# Altium project M-heat.PrjPcb
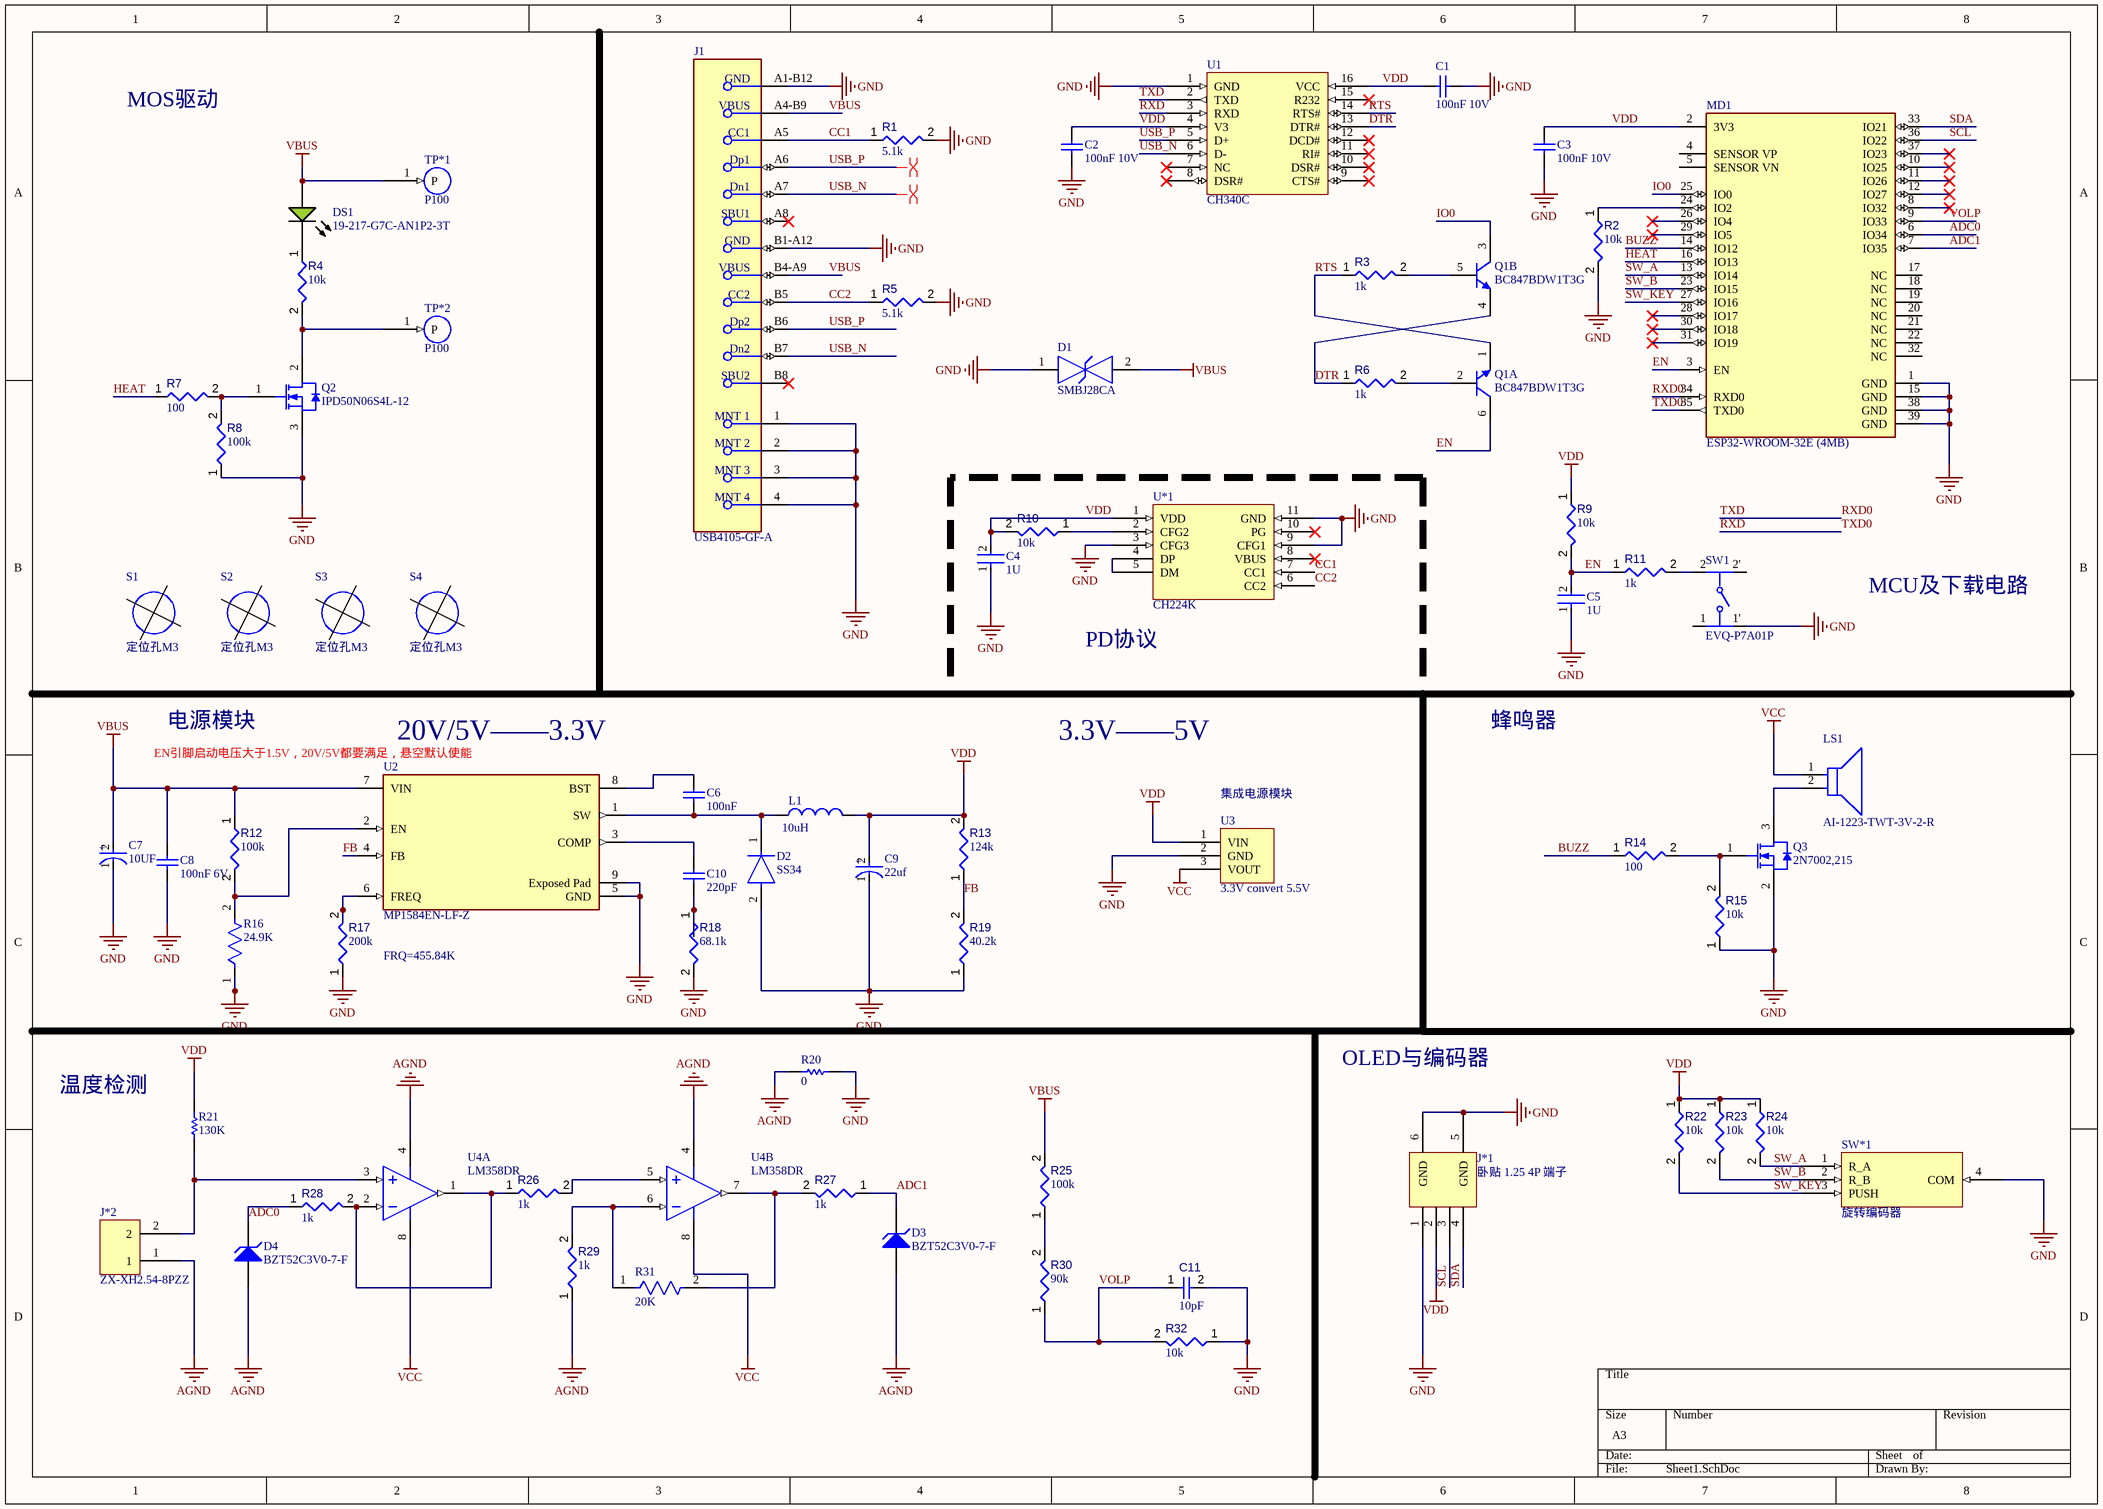
[diagram p0: Sheet1.SchDoc]
1 sheet, 70 parts. Net scope: global (net labels, ports and power ports of the same name join across sheets).
Board files: control_board.PcbDoc, Bed.pcbdoc, struct_board.PcbDoc

## Sheet Sheet1.SchDoc
size A3; SheetNumber: 1; SheetTotal: 1

### Parts
C1  100nF 10V  [CAPC0603(1608)100_M]
C2  100nF 10V  [CAPC0603(1608)100_M]
C3  100nF 10V  [CAPC0603(1608)100_M]
C4  1U  [FP-0603-L_1_6_0_15-W_0_81-IPC_A]
C5  1U  [FP-0603-L_1_6_0_15-W_0_81-IPC_A]
C6  100nF  [CAPC0603(1608)100_M]
C7  10UF  [FP-SC-MFG]
C8  100nF 6V  [CAPC0603(1608)100_M]
C9  22uf  [FP-TAJC-MFG]
C10  220pF  [CAPC1608X90X35LL10T15]
C11  value 10pF  [CAPC1608X90X40ML10T20]  (hidden comment: Capacitor 10 pF +/- 5% 50 V 0603)
D1  SMBJ28CA  [FP-SMBJ-CA-MFG]
D2  SS34  [FP-95401-MFG]
D3  BZT52C3V0-7-F  [DIOD-SOD123_V]
D4  BZT52C3V0-7-F  [DIOD-SOD123_V]
DS1  19-217-G7C-AN1P2-3T  [EVRL-0603-2_V]
J1  USB4105-GF-A  [FP-USB4105-GF-A-MFG]
J*1  卧贴 1.25 4P 端子  [卧贴 1.25 4P 端子-Footprint-1]
J*2  ZX-XH2.54-8PZZ  [ZX-XH2.54-8PZZ-Footprint-1]
L1  10uH  [INDM7266X28N]
LS1  AI-1223-TWT-3V-2-R  [FP-AI-1223-TWT-3V-2-R-MFG]
MD1  ESP32-WROOM-32E (4MB)  [FP-ESP32-WROOM-32E_4MB-MFG]
Q1  BC847BDW1T3G  [ONSC-SOT-363-6-419B-02_W_V]  (parts A,B of 2)
Q2  IPD50N06S4L-12  [INF-PG-TO252-3-11_M]
Q3  2N7002,215  [NXP-SOT23-3_V]
R1  value 5.1k  [RESC1608X55X25ML10T15]  (hidden comment: Resistor 5.1K +/-1% 0603 100 mW)
R2  value 10k  [RESC1608X55X25ML10T15]  (hidden comment: Resistor 1k +/-1% 0603 100 mW)
R3  value 1k  [RESC1608X55X25ML10T15]  (hidden comment: Resistor 1k +/-1% 0603 100 mW)
R4  value 10k  [RESC1608X55X25ML10T15]  (hidden comment: Resistor 10k +/-1% 0603 100 mW)
R5  value 5.1k  [RESC1608X55X25ML10T15]  (hidden comment: Resistor 1k +/-1% 0603 100 mW)
R6  value 1k  [RESC1608X55X25ML10T15]  (hidden comment: Resistor 1k +/-1% 0603 100 mW)
R7  value 100  [RESC0603(1608)_L]  (hidden comment: 100R3J)
R8  value 100k  [RESC1608X55X25ML10T15]  (hidden comment: Resistor 100k +/-1% 0603 100 mW)
R9  value 10k  [RESC1608X55X25ML10T15]  (hidden comment: Resistor 1k +/-1% 0603 100 mW)
R10  value 10k  [RESC1608X55X25ML10T15]  (hidden comment: Resistor 1k +/-1% 0603 100 mW)
R11  value 1k  [RESC1608X55X25ML10T15]  (hidden comment: Resistor 1k +/-1% 0603 100 mW)
R12  value 100k  [RESC1608X55X25ML10T15]  (hidden comment: Resistor 100k +/-1% 0603 100 mW)
R13  value 124k  [RESC1608X55X25ML10T15]  (hidden comment: Resistor 100k +/-1% 0603 100 mW)
R14  value 100  [RESC0603(1608)_L]  (hidden comment: 100R3J)
R15  value 10k  [RESC1608X55X25ML10T15]  (hidden comment: Resistor 10k +/-1% 0603 100 mW)
R16  24.9K  [FP-RC_L0603-MFG]
R17  value 200k  [RESC1608X55X25ML10T15]  (hidden comment: Resistor 100k +/-1% 0603 100 mW)
R18  value 68.1k  [RESC1608X55X25ML10T15]  (hidden comment: Resistor 100k +/-1% 0603 100 mW)
R19  value 40.2k  [RESC1608X55X25ML10T15]  (hidden comment: Resistor 100k +/-1% 0603 100 mW)
R20  value 0  [RESC1608X55X25ML10T15]  (hidden comment: Resistor 0R +/- 5% 0603 100 mW)
R21  130K  [RESC1609X50X30NL10T20]
R22  value 10k  [RESC1608X55X25ML10T15]  (hidden comment: Resistor 10k +/-1% 0603 100 mW)
R23  value 10k  [RESC1608X55X25ML10T15]  (hidden comment: Resistor 10k +/-1% 0603 100 mW)
R24  value 10k  [RESC1608X55X25ML10T15]  (hidden comment: Resistor 10k +/-1% 0603 100 mW)
R25  value 100k  [RESC1608X55X25ML10T15]  (hidden comment: Resistor 100k +/-1% 0603 100 mW)
R26  value 1k  [RESC1608X55X25ML10T15]  (hidden comment: Resistor 1k +/-1% 0603 100 mW)
R27  value 1k  [RESC1608X55X25ML10T15]  (hidden comment: Resistor 1k +/-1% 0603 100 mW)
R28  value 1k  [RESC1608X55X25ML10T15]  (hidden comment: Resistor 1k +/-1% 0603 100 mW)
R29  value 1k  [RESC1608X55X25ML10T15]  (hidden comment: Resistor 1k +/-1% 0603 100 mW)
R30  value 90k  [RESC1608X55X25ML10T15]  (hidden comment: Resistor 90k +/-1% 0603 100 mW)
R31  20K  [FP-RC0603-0_55-IPC_C]
R32  value 10k  [RESC1608X55X25ML10T15]  (hidden comment: Resistor 10k +/-1% 0603 100 mW)
S1  定位孔M3  [定位孔M3-Footprint-1]
S2  定位孔M3  [定位孔M3-Footprint-1]
S3  定位孔M3  [定位孔M3-Footprint-1]
S4  定位孔M3  [定位孔M3-Footprint-1]
SW1  EVQ-P7A01P  [FP-EVQ-P7A01P-MFG]
SW*1  旋转编码器  [旋转编码器-Footprint-1]
TP*1  P100  [P100-Footprint-1]
TP*2  P100  [P100-Footprint-1]
U1  CH340C  [SOP127P610X180-16N]
U2  MP1584EN-LF-Z  [FP-MP1584EN-LF-Z-MFG]
U3  3.3V convert 5.5V  [3.3V convert 5.5V-Footprint-1]
U4  LM358DR  [D0008A_L]  (parts A,B of 2)
U*1  CH224K  [SOP100P610X180_HS-12N]

### Nets
AGND: D3.1(A) D4.1(A) J*2.1 R20.1 R29.1 U4.4(GND)
GND: C1.2 C2.1 C3.2 C4.1 C5.1 C7.1(C) C8.1 C9.1(C) C11.2 D1.1 D2.2(A) J1.1(MNT_1) J1.2(MNT_2) J1.3(MNT_3) J1.4(MNT_4) J1.A1-B12(GND) J1.B1-A12(GND) J*1.1 J*1.5(GND) J*1.6(GND) MD1.1(GND) MD1.15(GND) MD1.38(GND) MD1.39(GND) Q2.3(SOURCE) Q3.2(S) R1.2 R2.2 R5.2 R8.1 R15.1 R16.1 R17.1 R18.2 R19.1 R20.2 R32.1 SW1.1' SW*1.4(COM) U1.1(GND) U2.5(GND) U2.9(Exposed_Pad) U3.2(GND) U*1.3(CFG3) U*1.9(CFG1) U*1.11(GND)
VBUS: C7.2(A) C8.2 D1.2 DS1.1(A) J1.A4-B9(VBUS) J1.B4-A9(VBUS) R12.1 R25.2 TP*1.1(P) U2.7(VIN)
VCC: LS1.1(C) U3.3(VOUT) U4.8(VCC)
VDD: C1.1 C2.2 C3.1 C4.2 C9.2(A) J*1.2 L1.2 MD1.2(3V3) R9.1 R10.2 R13.2 R21.2 R22.1 R23.1 R24.1 U1.4(V3) U1.16(VCC) U3.1(VIN) U*1.1(VDD)
ADC0: D4.2(K) MD1.6(IO34) R28.1
ADC1: D3.2(K) MD1.7(IO35) R27.1
BUZZ: MD1.14(IO12) R14.1
CC1: J1.A5(CC1) R1.1 U*1.7(CC1)
CC2: J1.B5(CC2) R5.1 U*1.6(CC2)
DTR: Q1.4(E) R6.1 U1.13(DTR#)
EN: C5.2 MD1.3(EN) Q1.6(C) R9.2 R11.1
FB: R13.1 R19.2 U2.4(FB)
HEAT: MD1.16(IO13) R7.1
IO0: MD1.25(IO0) Q1.3(C)
RTS: Q1.1(E) R3.1 U1.14(RTS#)
RXD: MD1.35(TXD0) U1.3(RXD)  [also labelled TXD0]
RXD0: MD1.34(RXD0) U1.2(TXD)  [also labelled TXD]
SCL: J*1.3 MD1.36(IO22)
SDA: J*1.4 MD1.33(IO21)
SW_A: MD1.13(IO14) R24.2 SW*1.1(R_A)
SW_B: MD1.23(IO15) R23.2 SW*1.2(R_B)
SW_KEY: MD1.27(IO16) R22.2 SW*1.3(PUSH)
USB_N: J1.A7(Dn1) J1.B7(Dn2) U1.6(D-)
USB_P: J1.A6(Dp1) J1.B6(Dp2) U1.5(D+)
VOLP: C11.1 MD1.9(IO33) R30.1 R32.2
NetC6_1: C6.1 D2.1(C) L1.1 U2.1(SW)
NetC6_2: C6.2 U2.8(BST)
NetC10_1: C10.1 U2.3(COMP)
NetC10_2: C10.2 R18.1
NetDS1_2: DS1.2(K) R4.1
NetJ*2_2: J*2.2 R21.1 U4.3(1IN+)
NetLS1_2: LS1.2(A) Q3.3(D)
NetMD1_24: MD1.24(IO2) R2.1
NetQ1_2: Q1.2(B) R6.2
NetQ1_5: Q1.5(B) R3.2
NetQ2_1: Q2.1(GATE) R7.2 R8.2
NetQ2_2: Q2.2(DRAIN) R4.2 TP*2.1(P)
NetQ3_1: Q3.1(G) R14.2 R15.2
NetR10_1: R10.1 U*1.2(CFG2)
NetR11_2: R11.2 SW1.2
NetR12_2: R12.2 R16.2 U2.2(EN)
NetR17_2: R17.2 U2.6(FREQ)
NetR25_1: R25.1 R30.2
NetR26_1: R26.1 R28.2 U4.1(1OUT) U4.2(1IN-)
NetR26_2: R26.2 U4.5(2IN+)
NetR27_2: R27.2 R31.2 U4.7(2OUT)
NetR29_2: R29.2 R31.1 U4.6(2IN-)
NetU*1_4: U*1.4(DP) U*1.5(DM)

Not connected (* = marked no-connect by the designer): J1 A8(SBU1)* B8(SBU2)*; MD1 4(SENSOR_VP) 5(SENSOR_VN) 8(IO32)* 10(IO25)* 11(IO26)* 12(IO27)* 17(NC) 18(NC) 19(NC) 20(NC) 21(NC) 22(NC) 26(IO4)* 28(IO17)* 29(IO5)* 30(IO18)* 31(IO19)* 32(NC) 37(IO23)*; SW1 1 2'; U1 7(NC)* 8(DSR#)* 9(CTS#)* 10(DSR#)* 11(RI#)* 12(DCD#)* 15(R232)*; U*1 8(VBUS)* 10(PG)*

### Layout directives
differential pair: USB_N, USB_P

### Notes on the sheet
- MOS驱动
- (near U*1) PD协议
- MCU及下载电路
- EN引脚启动电压大于1.5V，20V/5V都要满足，悬空默认使能
- 电源模块
- (near U2) 20V/5V——3.3V
- 3.3V——5V
- 蜂鸣器
- (near U3) 集成电源模块
- FRQ=455.84K
- 温度检测
- OLED与编码器
- (in symbol CMP-04424-000472-1) +
- (in symbol CMP-05427-000087-1) +

### Library data of the parts
C1-C3 C6 C8 = CMP-1035-02580-1: CAP 100nF 10V ±10% 0603 (1608 Metric) Thickness 1mm SMD; Tolerance: Â±10%; Case-EIA: 0603; Case-Metric: 1608; Max Thickness: 1 mm; Value: 100nF; Rated Voltage: 10 V; Technology: SMT
C4 C5 = CMP-2006-04474-2: General Purpose Ceramic Capacitor, 0603, 1uF, 10%, X5R, 15%, 6.3V
C7 = CMP-05427-000087-1: CAP ALUM 10UF 20% 35V SMD; Lead Length: 2.2mm; Leakage Current: 3uA; Ripple Current (AC): 30mA; Life (Hours): 2000Hour; RoHS Compliant: Yes; Case/Package: Radial; REACH SVHC: No SVHC; Max Operating Temperature: 85°C; Series: S; Number of Pins: 2; Min Operating Temperature: -40°C; Packaging: Tape and Reel; Termination: SMD/SMT; Voltage Rating: 35V; Tolerance: 20%; Length: 5.5mm; Height - Seated (Max): 0.213inch; Voltage Rating (DC): 35V; Height: 5.4mm; Radiation Hardening: No; Width: 5.3mm; Diameter: 5mm; Ripple Current: 30mA; Voltage: 35V; Package Quantity: 1; Capacitance: 10uF; Mount: Surface Mount; Contact Plating: Tin; Construction: Cylindrical; Lead Pitch: 1.5mm
C9 = CMP-04424-000472-1: 220uF 6.3V  ±10% 1.2Ω 2312  SMD Tantalum Capacitor; Polarity: Polar; Dissipation Factor: 8%; Leakage Current: 13.9uA; ESR (Equivalent Series Resistance): 1.2R; Capacitance: 220uF; Voltage Rating (DC): 6.3V; REACH SVHC: No SVHC; Construction: Flat; Dielectric Material: Tantalum; Depth: 3.2mm; Width: 3.2mm; RoHS Compliant: Yes; Case Code (Imperial): 2312; Max Operating Temperature: 125°C; Tolerance: 10%; Case/Package: 2412; Mount: Surface Mount; Voltage: 6.3V; Series: TAJ; Voltage Rating: 6.3V; Height - Seated (Max): 0.11inch; Package Quantity: 500; Height: 2.6mm; Number of Pins: 2; Case Code (Metric): 6032; Termination: SMD/SMT; Lead Free: Lead Free; Length: 6mm; Min Operating Temperature: -55°C; Radiation Hardening: No; Packaging: Tape and Reel; Features: General Purpose
C10 = CMP-2006-02613-1: Manufacturer: Murata; Part Number: GRM1885C1H151JA01D
C11 = CMP-001-00014-6: Chip Capacitor, 10 pF, +/- 5%, 50 V, 0603 (1608 Metric); Capacitor Type: Ceramic; Voltage Rating: 50V; RoHS Compliant: True; Case/Package: 0603; Max Operating Temperature: 125°C; Pins: 2; Tolerance: 5%; Mounting Technology: SM; Min Operating Temperature: -55°C
D1 = CMP-08607-000057-1: TVS DIODE 28V 45.4V DO214AA; Manufacturer: Littelfuse Inc; Peak Pulse Current: 13.3A; Breakdown Voltage: 31.1V; Peak Pulse Power: 600W; Direction: Bidirectional; Max Junction Temp: +150°C; Number Of Channels: 1; Automotive: No; Height: 2.61mm; Clamping Voltage: 45.4V; Reverse Standoff Voltage: 28V; ComponentLink2URL: https://www.littelfuse.com/~/media/electronics/datasheets/tvs_diodes/littelfuse_tvs_diode_smbj_datasheet.pdf.pdf; Temperature Range High: +150°C; Mouser Description: In a Pack of 10, Littelfuse SMBJ28CA, Bi-Directional TVS Diode, 600W, 2-Pin DO-214AA; Manufacturer Part Number: SMBJ28CA; ComponentLink2Description: Datasheet; Digikey Description: TVS DIODE 28V 45.4V DO214AA; Device Class L3: unset; Package: SMBJ-CA; Lead Free: Yes; Temperature: -65°C to +150°C; Octopart: https://octopart.com/smbj28ca-littelfuse-350757; Device Class L1: Circuit Protection; Category: Diode; RoHS: TRUE; Device Class L2: TVS Diodes; Temperature Range Low: -65°C
D2 = CMP-02540-000056-1: DIODE GEN PURP 600V 2A DO214AA; Peak Non-Repetitive Surge Current: 35A; Forward Current: 1A; Reverse Recovery Time: 75ns; Element Configuration: Single; Max Reverse Current: 5uA; Reverse Recovery Time-Max: 50ns; Polarity: Standard; Forward Voltage: 1.25V; Average Rectified Current: 2A; Width: 3.94mm; Series: -; Mount: Surface Mount; Max Reverse Voltage (DC): 600V; Max Repetitive Reverse Voltage (Vrrm): 600V; Max Operating Temperature: 175°C; Package Quantity: 750; Min Operating Temperature: -65°C; Output Current: 1A; Number of Pins: 2; Current Rating: 1A; Voltage Rating (DC): 600V; Reverse Voltage: 600V; Height: 2.24mm; Recovery Time: 75ns; Max Surge Current: 35A; Length: 4.57mm; Lead Free: Lead Free; Max Forward Surge Current (Ifsm): 35A; Radiation Hardening: No; Case/Package: SMB; Packaging: Tape and Reel
D3 D4 = CMP-2000-05974-1: Surface Mount Zener Diode, 3 V, -65 to 150 degC, 2-Pin SOD123, RoHS, Tape and Reel; Unit Weight: 0.000353oz; Voltage Temperature Coefficient: -1.75mV/C; Zener Current: 5mA; Zz - Zener Impedance: 95Ohms; Pd - Power Dissipation: 500mW; Configuration: Single; Voltage Tolerance: 5%; Vz - Zener Voltage: 3V; Brand: DiodesIncorporated; Ir - Reverse Current: 10uA; Package Description: 2-Pin Surface Mount Device, Body 2.7 x 1.55 mm; Length: 2.85mm; Package Reference: SOD123; Width: 1.7mm; RoHS: True; Packaging: Reel; Datasheet Version: Rev. 37-2, 09/2012; Datasheet URL: http://www.diodes.com/_files/datasheets/ds18004.pdf; Maximum Operating Temperature: +150C; Product Category: ZenerDiodes; Minimum Operating Temperature: -65C; Mounting Technology: SurfaceMount; Mounting Style: SMD/SMT; Series: BZT52C; Height: 1.35mm; Factory Pack Quantity: 3000; Manufacturer URL: http://www.diodes.com/; Package / Case: SOD-123; Termination Style: SMD/SMT; Manufacturer: DiodesIncorporated
DS1 = CMP-007-00002-2: Chip LED, Yellow-Green, 5 V, 25 mA, -40 to 85 degC, 2-Pin SMD (0603), RoHS, Tape and Reel; Manufacturer: Everlight Electronics; Forward Voltage: 2V; Lens Style: Clear; Viewing Angle: 120degrees; Colour: Green; Mounting Technology: SM; Datasheet Version: Rev. 1, 04/2006; Package Description: 2-Pin Surface Mount Device, Body 1.6 x 0.8 mm; RoHS Compliant: True; Package Reference: 0603; Pins: 2; Manufacturer URL: http://www.everlight.com/; Datasheet URL: https://datasheet.ciiva.com/48679/19-217-g7c-an1p2-3t-48679179.pdf; Case/Package: 0603
J1 = CMP-245163-000001-1: CONN RCPT USB2.0 TYPEC 5A; Manufacturer: GCT; Voltage Rating: 20V; Is Female: yes; Current Rating: 5/6.25/1.25/0.25A; Number Of Contacts: 16; Conn Orientation: Right Angle; Device Class L1: Connectors; Category: Conn; Lead Free: Yes; RoHS: TRUE; Temperature Range High: +85°C; Digikey Description: CONN RCPT USB2.0 TYPEC 5A; Device Class L3: unset; ComponentLink2Description: Datasheet; Manufacturer Part Number: USB4105-GF-A; Package: 0; Usb Standard: USB 2.0; Device Class L2: USB Connectors; Automotive: No; Temperature Range Low: -40°C; Height: 3.46mm; Temperature: -40°C to +85°C; Contact Material: Gold,Nickel; ComponentLink2URL: https://gct.co/files/drawings/usb4105.pdf; Octopart: https://octopart.com/usb4105-gf-a-gct-106627878
J*1 = CMP-002-00072-4: ZX-MX1.25-4PJK; Pins: 6
J*2 = CMP-002-00074-1
L1 = CMP-006-00021-1: SMD，7*6.6*2.8mm（0603） 合金电感，一体成型电感，大电流; Pins: 2
LS1 = CMP-103888-000003-1: BUZZER MAGNETIC 3V 12MM TH; Operating Supply Current: 30mA; Max Supply Voltage (DC): 4V; Input Type: DC; Min Supply Voltage (DC): 2V; Frequency: 2.3kHz; Mount: Through Hole; Nominal Supply Voltage (DC): 3V; Height: 7.5mm; Diameter: 12mm; Max Operating Temperature: 70°C; Min Operating Temperature: -20°C; Series: AI; Termination: PC Pins; Voltage Rating: 3V; Packaging: Tray; Max Supply Current: 30mA; Sensing Method: Magnetic; Contact Plating: Tin
MD1 = CMP-194065-000026-1: RX TXRX MOD WIFI TRACE ANT SMD
Q1 = CMP-1048-00885-1: Dual General Purpose Transistors, NPN, 6-Pin SOT-363, Pb-Free, Tape and Reel; Manufacturer: On Semiconductor; Polarity: Dual NPN; IC Continuous (A): 0.1; fT Min (MHz): 100; PackageDescription: 6-Pin Small Outline Transistor, Body 2 x 1.25 mm, Pitch 0.65 mm; ComponentLink3Description: Package Specification; PackageVersion: Rev. W, 01/2006; DatasheetVersion: Rev. 9; ComponentLink1Description: Manufacturer URL; ComponentLink2Description: Datasheet; ComponentLink2URL: http://www.onsemi.cn/pub_link/Collateral/BC846BDW1T1-D.PDF; ComponentLink3URL: http://www.onsemi.com/pub_link/Collateral/NTJD4001N-D.PDF; PackageReference: SOT-363-6-419B-02_W; ComponentLink1URL: http://www.onsemi.com/; Mounting Technology: Surface Mount; Packing: Tape and Reel; PartNumber: BC847BDW1T3G; RoHS: TRUE
Q2 = CMP-1138-00106-1: OptiMOS-T2 Power-Transistor, 60 V VDS, 50 A ID, PG-TO252-3-11, Reel, Green; Manufacturer: Infineon; QG: 30 nC; RDS (on) (max) (@10V): 12 mOhm; VGS(th) (max): 2.2 V; VGS(th) (min): 1.2 V; Ptot (max): 50 W; RDS (on) (max) (@4.5V): 21.6 mOhm; ID (max): 50 A; RthJC (max): 3 K/W; VDS (max): 60 V; IDpuls (max): 200 A; Green: TRUE; ComponentLink1URL: http://www.infineon.com/; ComponentLink3URL: http://www.infineon.com/dgdl/BTS142_DS_13.pdf?folderId=db3a3043163797a6011667aa084c0e01&fileId=db3a3043163797a6011667ac98be0e02&location=en.Products.Automotive_ICs.Smart_High-_and_Low-Side_Switches.HITFET___TEMPFET__-_Smart_Low-Side_Switches.DATASHEET.BTS1; ComponentLink2URL: http://www.infineon.com/dgdl/IPD50N06S4L-12_DS_10.pdf?folderId=db3a30431a5c32f2011a8084a04a6500&fileId=db3a30431ff9881501203885cc580ca0&location=en.Products.Automotive_ICs.Automotive_MOSFETs.Single__N-Channel_60V_MOSFETs.DATASHEET.IPD50N06S4L-12_DS_10.pdf; DatasheetVersion: Rev. 1.0; Packing: Reel; ComponentLink2Description: Datasheet; Mounting Technology: Surface Mount; Technology: OptiMOS-T2; PackageVersion: Dec-06; ComponentLink3Description: Package Specification; PackageReference: PG-TO252-3-11; PartNumber: IPD50N06S4L-12; Halogen-free: TRUE; PackageDescription: 3-Pin Plastic (Green) Transistor Single Outline Package, 6.5 x 6.12 mm Body, 2.28 mm Pitch; ComponentLink1Description: Manufacturer URL
Q3 = CMP-013-00011-4: N-channel Trench MOSFET, 60 V, 300 mA, -65 to 150 degC, 3-Pin SOT-23 (TO-236AB), RoHS, Tape and Reel; Manufacturer: NXP Semiconductors; Elements: 1; Power: 830mW; Max Dual Supply Voltage: 60V; Rds On Max: 5Ohm; Package Version: Feb-16; Nominal Vgs: 2V; Input Capacitance: 50pF; RoHS Compliant: True; Datasheet URL: http://www.nxp.com/documents/data_sheet/2N7002.pdf; Packaging: TapeandReel; Case/Package: TO-236-3; Package Reference: SOT23-3; Max Operating Temperature: 150°C; Pins: 8; Mounting Technology: SM; Package Quantity: 1; Datasheet Version: Rev. 7, 09/2011; Nominal Dual Supply Voltage: 60V; Min Operating Temperature: -65°C; Package Description: 3-Pin Small Outline Transistor, Body 1.3 x 2.9 mm, Pitch 0.95 mm; Vds Max: 60V
R1 = CMP-009-00031-5: Chip Resistor, 5.1 KOhm, +/- 1%, 0.1 W, -55 to 155 degC, 0603 (1608 Metric); Power: 100mW; Tolerance: 1%; Mounting Technology: SM; Case/Package: 0603; RoHS Compliant: True; Pins: 2; Min Operating Temperature: -55°C; Max Operating Temperature: 155°C
R2 R5 R9-R11 R26 R27 R29 = CMP-009-00031-5: Chip Resistor, 4.7 KOhm, +/- 1%, 0.1 W, -55 to 155 degC, 0603 (1608 Metric); Power: 100mW; Tolerance: 1%; Mounting Technology: SM; Case/Package: 0603; RoHS Compliant: True; Pins: 2; Min Operating Temperature: -55°C; Max Operating Temperature: 155°C
R3 R6 R28 = CMP-009-00014-5: Chip Resistor, 1 KOhm, +/-1%, 0.1 W, -55 to 155 degC, 0603 (1608 Metric); Voltage Rating: 50V; Power: 100mW; Tolerance: 1%; Mounting Technology: SM; Pins: 2; Case/Package: 0603; Min Operating Temperature: -55°C; RoHS Compliant: True; Max Operating Temperature: 155°C
R4 R15 R22-R24 R32 = CMP-009-00017-5: Chip Resistor, 10 KOhm, +/- 1%, 01 W, -55 to 155 degC, 0603 (1608 Metric); Voltage Rating: 50V; Power: 100mW; RoHS Compliant: True; Min Operating Temperature: -55°C; Pins: 2; Case/Package: 0603; Mounting Technology: SM; Max Operating Temperature: 155°C; Tolerance: 1%
R7 R14 = CMP-009-00069-2: 120R 0.1W 5% 0603 (1608 Metric)  SMD; Power: 100mW; Mounting Technology: SMT; Tolerance: 5%; Case/Package: 0603; Pins: 2
R8 R12 R13 R17-R19 R25 R30 = CMP-009-00023-5: Chip Resistor, 100 KOhm, +/- 1%, 0.1 W, -55 to 155 degC, 0603 (1608 Metric); Voltage Rating: 50V; Power: 100mW; Max Operating Temperature: 155°C; RoHS Compliant: True; Tolerance: 1%; Pins: 2; Case/Package: 0603; Mounting Technology: SM; Min Operating Temperature: -55°C
R16 = CMP-03412-013083-1: RES SMD 24.9K OHM 1% 1/10W 0603; Manufacturer Part Number: RC0603FR-0724K9L; Manufacturer: Yageo; Approved Alternate Part Number: 541-1.00HHCT-ND; Voltage Rating: 75V; Power Rating: 0.1W; Resistance: 24.9kΩ; Value: 24.9kΩ; Power: 100mW; Temperature Coefficient: 100ppm/°C; Footprint Url: https://www.yageo.com/upload/website/yageo_PYu-R_Mount_10_19050818_343.pdf; Automotive: No; Temperature Range Low: -55°C; Ipc Land Pattern Name: RESC16080X45; Digikey Description: RES SMD 24.9K OHM 1% 1/10W 0603; Voltage: 75V; Composition: Thick Film; Device Class L1: Passive Components; Device Class L2: Resistors; Device Class L3: Chip SMD Resistors; ComponentLink2URL: https://www.yageo.com/upload/media/product/productsearch/datasheet/rchip/PYu-RC_Group_51_RoHS_L_10.pdf; Series: RC_L; Octopart: https://octopart.com/rc0603fr-0724k9l-yageo-1189838; RoHS: TRUE; Category: Res; Height: 0.55mm; Tolerance: 1%; Temperature: -55°C to +155°C; Temperature Range High: +155°C; ComponentLink2Description: Datasheet; Package: RC_L0603; Lead Free: Yes; Mouser Description: Res Thick Film 1.6 x 0.8 mm 24.9K Ohm 1% 0.1W(1/10W) 100ppm/ C Molded SMD Paper T/R
R20 = CMP-009-00006-5: Chip Resistor, 0 Ohm, 0.1 W, -55 to 155 degC, 0603 (1608 Metric); Power: 100mW; Voltage Rating: 50V; Max Operating Temperature: 155°C; RoHS Compliant: True; Mounting Technology: SM; Case/Package: 0603; Min Operating Temperature: -55°C; Tolerance: 5%; Pins: 2
R21 = CMP-2000-03887-1: Manufacturer: Vishay Dale; Part Number: CRCW0603130KFKEA
R31 = CMP-2000-06932-2: RES 20K OHM 1% 1/10W 0603
S1-S4 = CMP-002-00073-3: M3定位孔
SW1 = CMP-011-00014-1: Switch Tactile N.O. SPST Rectangular Button Gull Wing 0.05A 12VDC 2.2N SMD Embossed T/R; Max Operating Temperature: 70°C; Min Operating Temperature: -20°C; Throw Configuration: SPST; Case/Package: SMD/SMT; Mounting Technology: Surface Mount
SW*1 = CMP-011-00013-4: MITSUMI  SIQ-02FVS3; Pins: 4
TP*1 TP*2 = CMP-002-00071-1: 测试探针 3A; Pins: 1
U1 = CMP-015-00009-1: USB转串; Pins: 16; Case/Package: SOP-16
U2 = CMP-57379-000006-1: IC REG BUCK ADJ 3A; Manufacturer: Monolithic Power Systems; Output Type: AdjustableProgrammable; Nominal Supply Current: 100uA; Switching Frequency: 100-1500kHz; Max Power Dissipation: 2.5W; Output Voltage: 0.8-25V; Max Junction Temp: +125°C; Min Supply Voltage: 4.5V; Max Supply Voltage: 28V; Number Of Outputs: 1; Standoff Height: 0mm; ComponentLink2URL: https://www.monolithicpower.com/en/documentview/productdocument/index/doc_url/L01QMTU4NF9yMS4wLnBkZg%3D%3D/release_date/MjAwOS0wNC0wOSAwMDowMDowMA%3D%3D/; Lead Free: Yes; Package: MP1584EN-LF-Z; Temperature Range Low: -20°C; Temperature: -20°C to +125°C; Height: 1.7mm; Ambient Temperature Range Low: -20°C; RoHS: TRUE; Automotive: No; Ipc Land Pattern Name: SOIC127P600X150-8; Ambient Temperature Range High: +85°C; Device Class L2: Power Management ICs; ComponentLink2Description: Datasheet; Manufacturer Part Number: MP1584EN-LF-Z; Device Class L3: Voltage Regulators - Switching; Octopart: https://octopart.com/mp1584en-lf-z-monolithic+power+systems-18629680; Category: IC; Output Current: 3A; Digikey Description: IC REG BUCK ADJ 3A; Temperature Range High: +125°C; Device Class L1: Integrated Circuits (ICs); Switching Topology: Buck
U3 = CMP-019-00052-3: 迷你升压模块
U4 = CMP-014-00024-2: Dual Operational Amplifier, 3 to 32 V, 0 to 70 degC, 8-Pin SOIC (D), Green (RoHS & no Sb/Br), Tape and Reel; Manufacturer: Texas Instruments (TI); Channels: 2; Min Supply Voltage: 1.5V; Max Supply Voltage: 16V; Package Version: 4040047-3/M, 06/2011; Common Mode Rejection Ratio: 65dB; Nominal Dual Supply Voltage: 12V; Output Current: 30mA; Slew Rate: 0.3V/us; Unity Gain Bandwidth Product: 700KHz; Nominal Supply Current: 1.2mA; Nominal Voltage Gain: 100dB; Packaging: CutTape; Manufacturer URL: http://www.ti.com/; RoHS Compliant: True; Datasheet Version: SLOS068T, 04/2015; Min Dual Supply Voltage: 1.5V; Max Operating Temperature: 70°C; Package Description: 8-Pin Small Outline Integrated Circuit, Body 4.9 x 3.9 mm, Pitch 1.27 mm; Package Reference: D0008A; Max Dual Supply Voltage: 16V; Nominal Supply Voltage: 12V; Mounting Technology: SM; Datasheet URL: http://www.ti.com/lit/ds/symlink/lm358.pdf; Case/Package: SOIC; Package URL: http://www.ti.com/lit/ml/msoi002j/msoi002j.pdf; Min Operating Temperature: 0°C; Pins: 8; Package Quantity: 1; Nominal Gain Bandwith Product: 700KHz
U*1 = CMP-015-00008-1: USB PD等多快充协议受电芯片CH224; Pins: 10; Max Operating Temperature: 105°C; Case/Package: ESSOP-10